# EAGLE design tx (EAGLE 9.1.3)
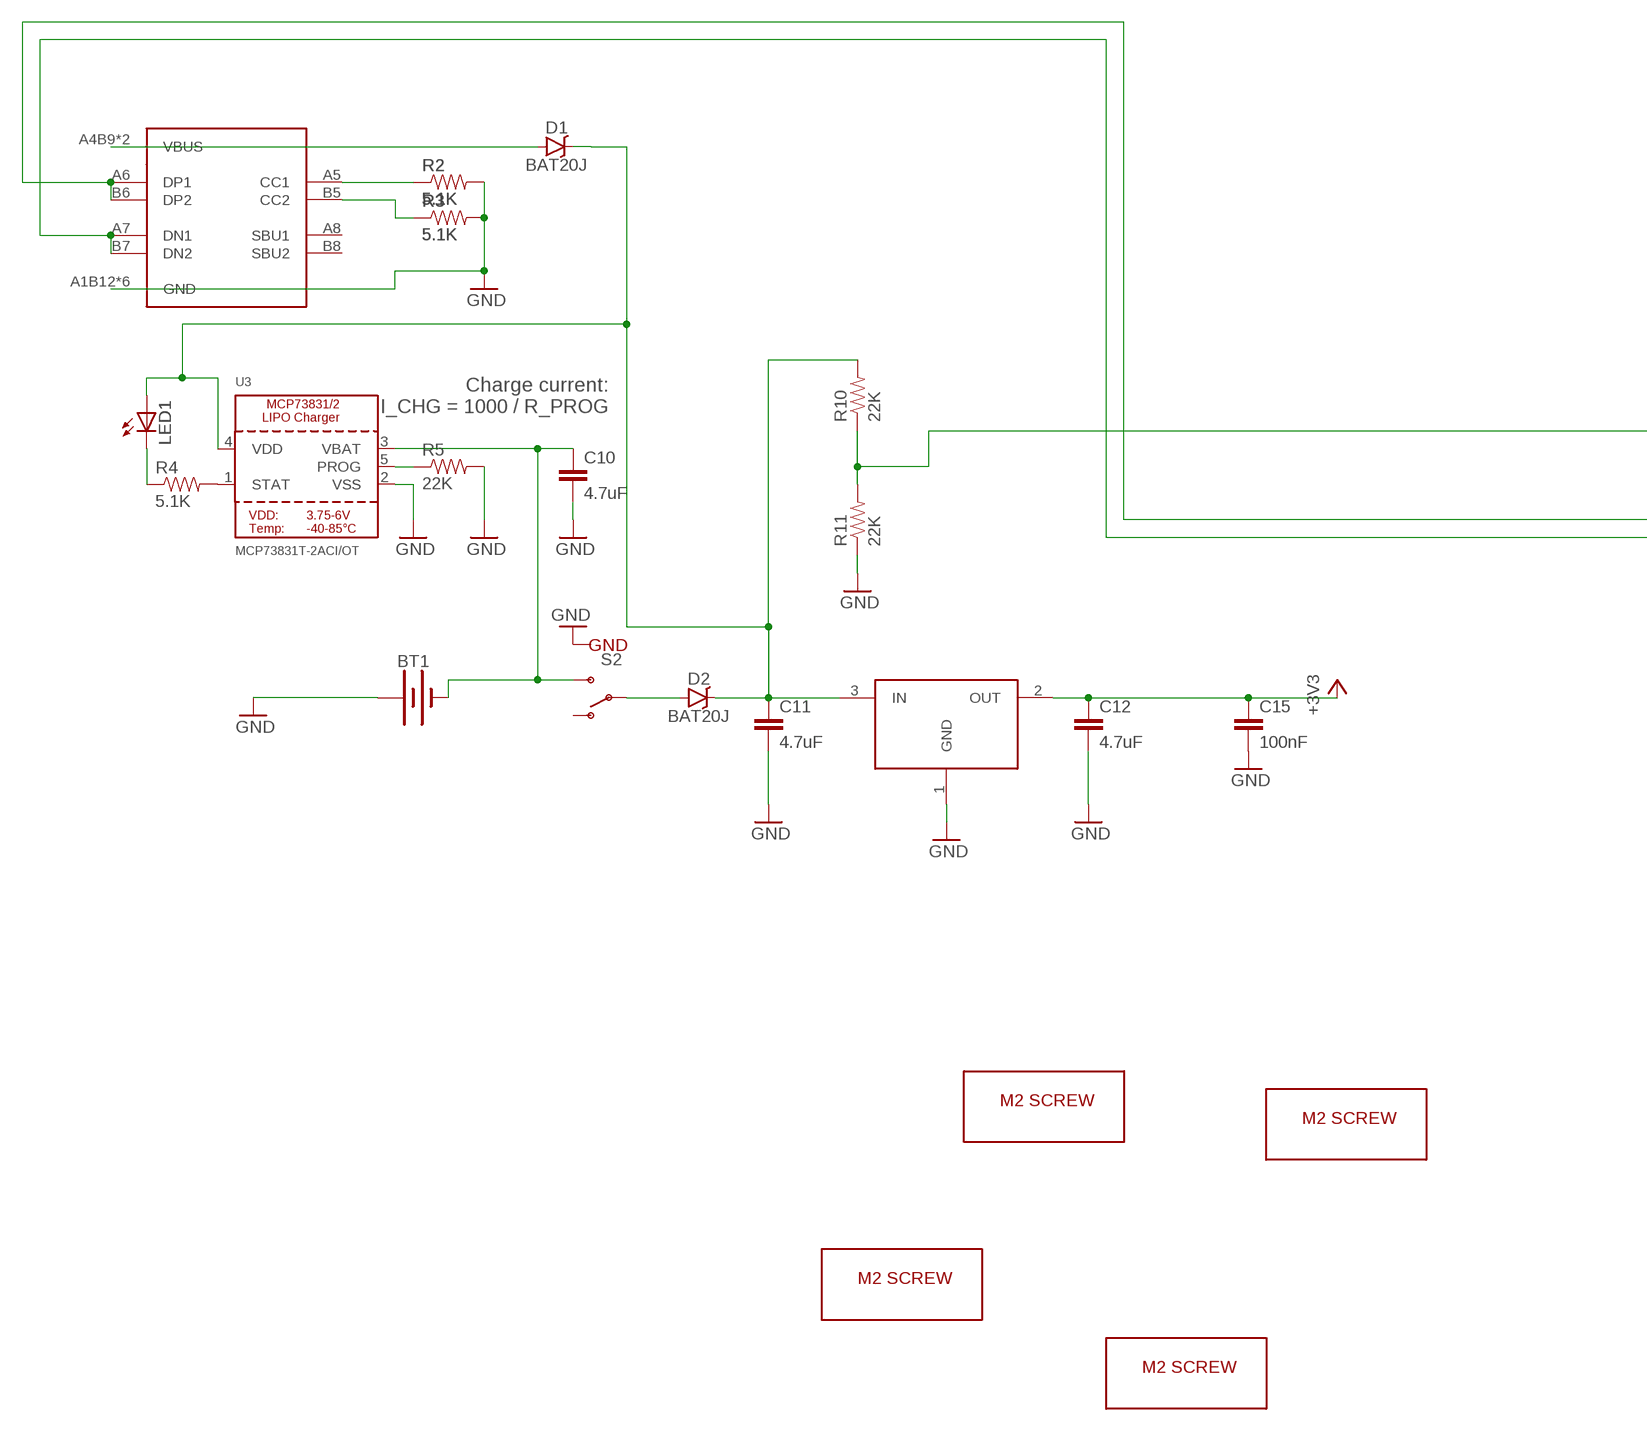
[diagram p0: schematic, sheet 1, part 1 of 2]
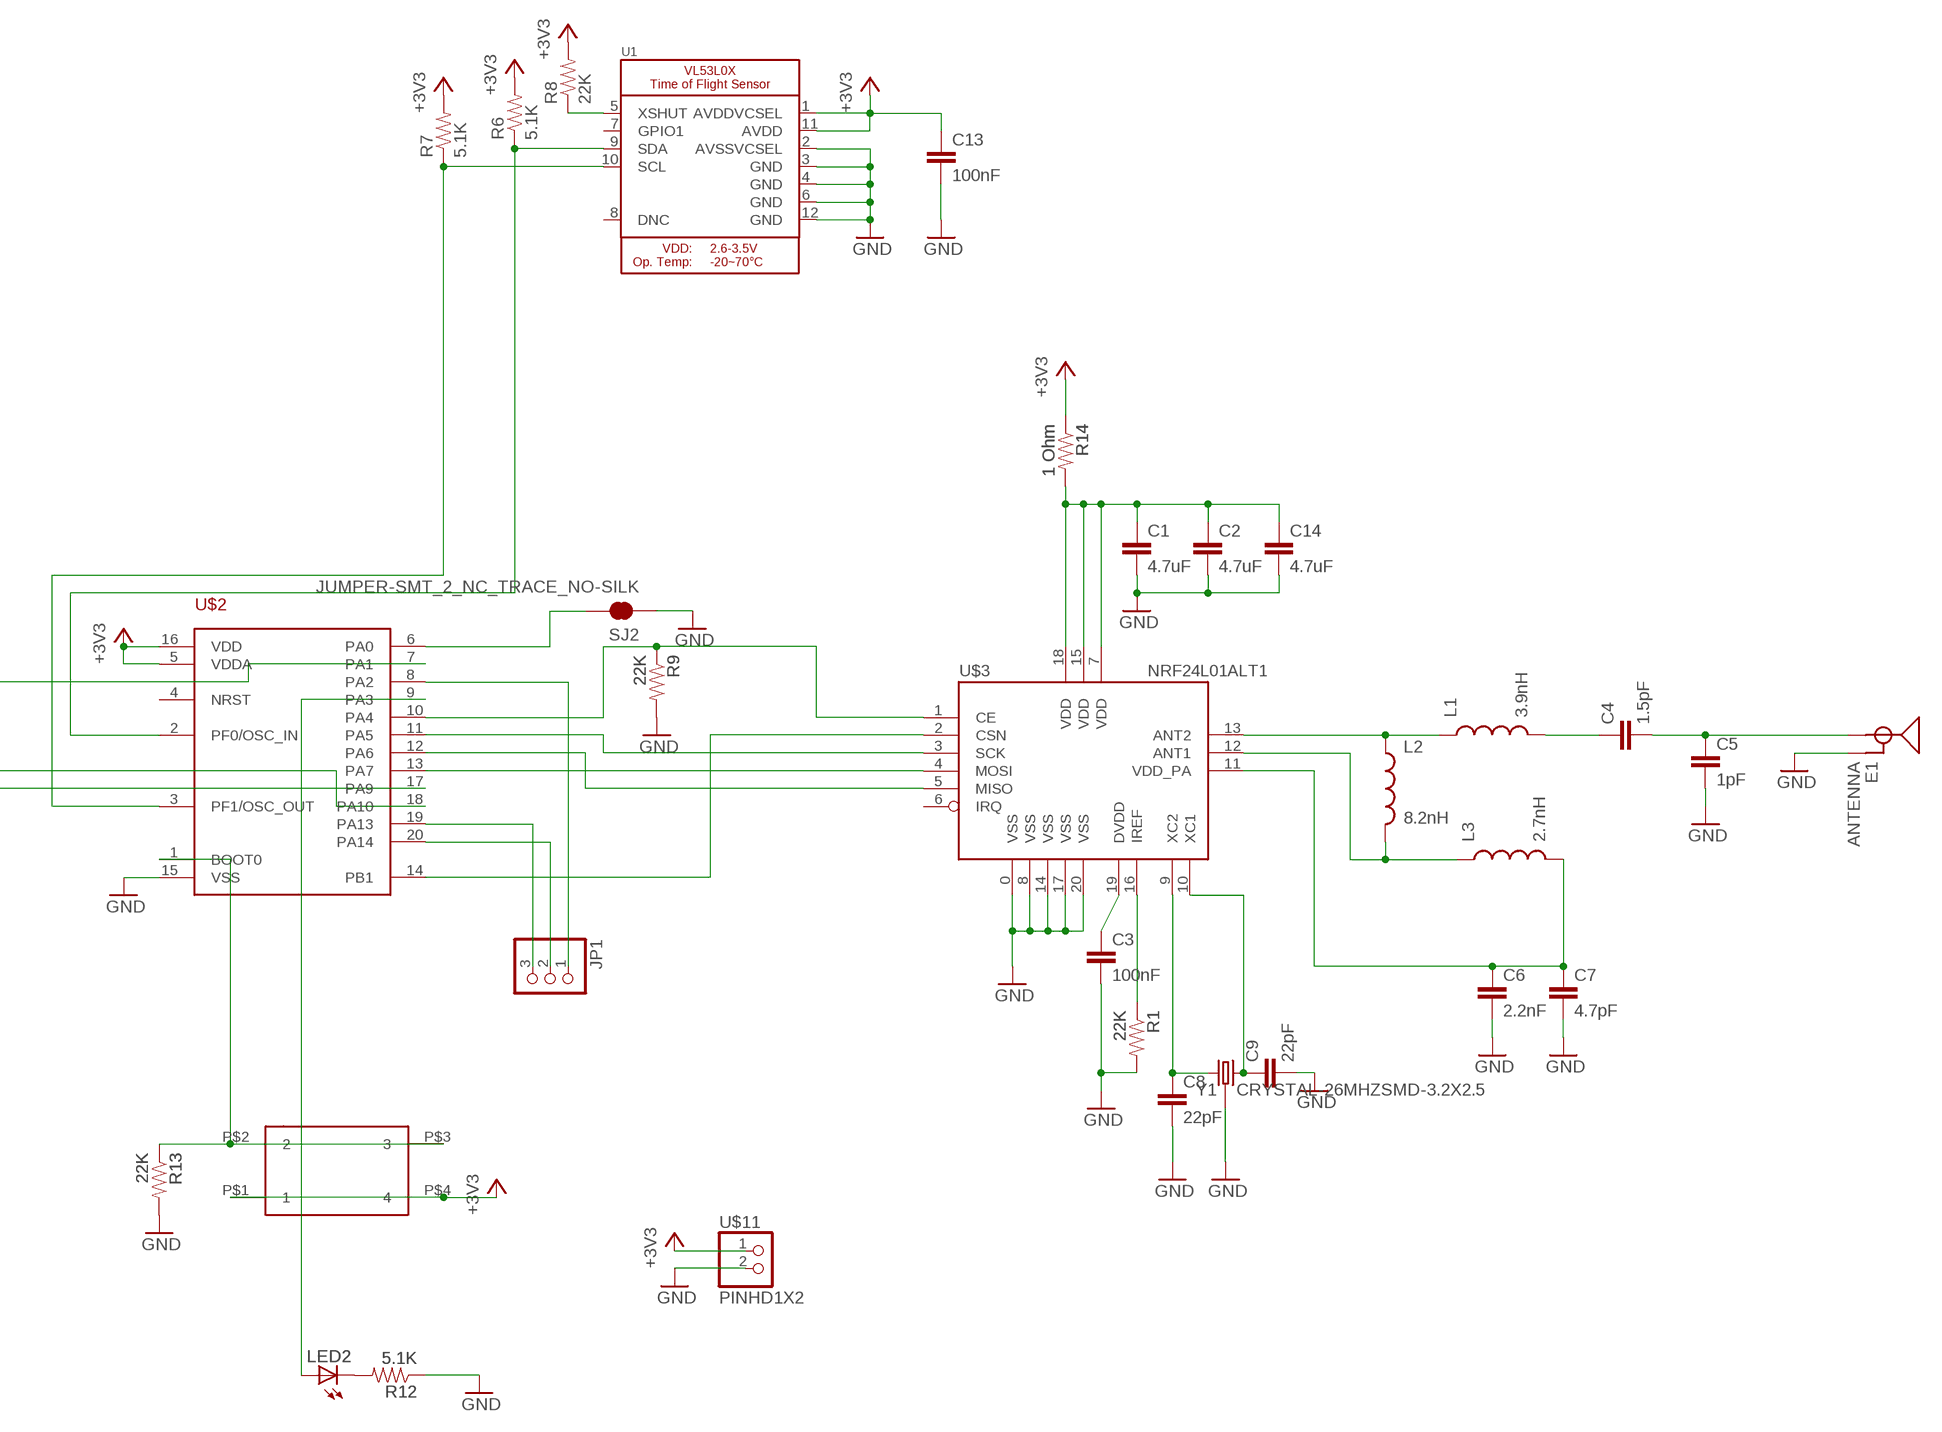
[diagram p1: schematic, sheet 1, part 2 of 2]

## Parts
BT1  TX_SPARKFUN-BATTERIES_BATTERY-24.5MM_PTH  [TX_SPARKFUN-BATTERIES_BATTCON_24.5MM_PTH]
C1  4.7uF  CAP0805  [0805]
C2  4.7uF  CAP0805  [0805]
C3  100nF  CAP0805  [0805]
C4  1.5pF  CAP0805  [0805]
C5  1pF  CAP0805  [0805]
C6  2.2nF  CAP0805  [0805]
C7  4.7pF  CAP0805  [0805]
C8  22pF  CAP0805  [0805]
C9  22pF  CAP0805  [0805]
C10  4.7uF  CAP0805  [0805]
C11  4.7uF  CAP0805  [0805]
C12  4.7uF  CAP0805  [0805]
C13  100nF  CAP0805  [0805]
C14  4.7uF  CAP0805  [0805]
C15  100nF  CAP0805  [0805]
D1  BAT20J  DIODE-SCHOTTKY-BAT20J  [SOD-323]
D2  BAT20J  DIODE-SCHOTTKY-BAT20J  [SOD-323]
E1  ANTENNA  ANTENNATRACE-TUNED  [TRACE_ANTENNA_2.4GHZ_25.7MM_TUNED]
JP1  PINHD-1X3CB  [1X03-CLEANBIG]
L1  3.9nH  INDUCTOR0805  [0805]
L2  8.2nH  INDUCTOR0805  [0805]
L3  2.7nH  INDUCTOR0805  [0805]
LED1  LEDCHIP-LED0805  [CHIP-LED0805]
LED2  LEDCHIP-LED0805  [CHIP-LED0805]
R1  22K  RESISTOR0805-RES  [0805]
R2  5.1K  RESISTOR0805-RES  [0805]
R3  5.1K  RESISTOR0805-RES  [0805]
R4  5.1K  RESISTOR0805-RES  [0805]
R5  22K  RESISTOR0805-RES  [0805]
R6  5.1K  RESISTOR0805-RES  [0805]
R7  5.1K  RESISTOR0805-RES  [0805]
R8  22K  RESISTOR0805-RES  [0805]
R9  22K  RESISTOR0805-RES  [0805]
R10  22K  RESISTOR0805-RES  [0805]
R11  22K  RESISTOR0805-RES  [0805]
R12  5.1K  RESISTOR0805-RES  [0805]
R13  22K  RESISTOR0805-RES  [0805]
R14  1 Ohm  RESISTOR0805-RES  [0805]
S2  SWITCH-SPDTTDFGDFG  [SWITCH-SPST-SMD-A]
SJ2  JUMPER-SMT_2_NC_TRACE_NO-SILK  [SMT-JUMPER_2_NC_TRACE_NO-SILK]
U1  VL53L0X  [LGA12_ST]
U3  MCP73831T-2ACI/OT  MCP73831/2  [SOT23-5]
U$1  M2_SCREW_DEV  [M2_SCREW_FOOT]
U$2  STM32F030F4  [TSSOP20]
U$3  NRF24L01ALT1  [QFN20_ALT1]
U$4  USBC_16P  [USBC_16P_FOOT]
U$9  XC6206_DEV  [SOT23R_INFINEON]
U$10  324_SW324_SWITCH_FOOT_HOLE  [342_SWICH_FOOT_HOLE]
U$11  PINHD1X2  [1X02]
U$12  M2_SCREW_DEV  [M2_SCREW_FOOT]
U$13  M2_SCREW_DEV  [M2_SCREW_FOOT]
U$14  M2_SCREW_DEV  [M2_SCREW_FOOT]
Y1  CRYSTAL-26MHZSMD-3.2X2.5  [CRYSTAL-SMD-3.2X2.5MM]

## Nets
+3V3: C12.1 C13.1 C15.1 R6.2 R7.2 R8.2 R14.1 U1.1(AVDDVCSEL) U1.11(AVDD) U$2.5(VDDA) U$2.16(VDD) U$9.2(OUT) U$10.P$1 U$10.P$4 U$11.1
GND: BT1.2(+) C1.2 C2.2 C3.2 C5.2 C6.2 C7.2 C8.2 C9.2 C10.2 C11.2 C12.2 C13.2 C14.2 C15.2 E1.GND E1.GND2(GND) R1.2 R2.2 R3.2 R5.2 R9.2 R11.1 R12.1 R13.2 S2.G1(GND) S2.G2(GND) S2.G3(GND) S2.G4(GND) SJ2.1 U1.2(AVSSVCSEL) U1.3(GND) U1.4(GND) U1.6(GND) U1.12(GND) U3.2(VSS) U$2.15(VSS) U$3.0(VSS) U$3.8(VSS) U$3.14(VSS) U$3.17(VSS) U$3.20(VSS) U$4.A1B12(GND) U$4.B11A12(GND) U$4.P$13(GND) U$4.P$14(GND) U$4.P$15(GND) U$4.P$16(GND) U$9.1(GND) U$11.2 Y1.2 Y1.4
N$1: C3.1 U$3.19(DVDD)
N$2: R1.1 U$3.16(IREF)
N$3: L1.1 L2.1 U$3.13(ANT2)
N$4: C4.1 L1.2
N$5: C4.2 C5.1 E1.ANT(SIGNAL)
N$6: L2.2 L3.1 U$3.12(ANT1)
N$7: C8.1 U$3.9(XC2) Y1.1
N$8: C6.1 C7.1 L3.2 U$3.11(VDD_PA)
N$9: C9.1 U$3.10(XC1) Y1.3
N$10: R3.1 U$4.B5(CC2)
N$11: R2.1 U$4.A5(CC1)
N$12: LED1.C R4.1
N$13: R4.2 U3.1(STAT)
N$14: U$2.13(PA7) U$3.4(MOSI)
N$15: U$2.12(PA6) U$3.5(MISO)
N$16: U$2.11(PA5) U$3.3(SCK)
N$17: R5.1 U3.5(PROG)
N$18: U$2.18(PA10) U$4.A6(DP1) U$4.B6(DP2)
N$19: D2.A S2.2(P)
N$20: U$2.14(PB1) U$3.2(CSN)
N$21: R9.1 U$2.10(PA4) U$3.1(CE)
N$22: R7.1 U1.10(SCL) U$2.3(PF1/OSC_OUT)
N$23: R6.1 U1.9(SDA) U$2.2(PF0/OSC_IN)
N$24: R8.1 U1.5(XSHUT)
N$25: BT1.1(-) C10.1 S2.3(S) U3.3(VBAT)
N$26: D1.A U$4.A4B9(VBUS) U$4.B4A9(VBUS)
N$27: C11.1 D1.C D2.C LED1.A R10.2 U3.4(VDD) U$9.3(IN)
N$28: LED2.C R12.2
N$29: LED2.A U$2.9(PA3)
N$30: R13.1 U$2.1(BOOT0) U$10.P$2 U$10.P$3
N$31: JP1.3 U$2.19(PA13)
N$32: JP1.2 U$2.20(PA14)
N$33: JP1.1 U$2.8(PA2)
N$34: U$2.17(PA9) U$4.A7(DN1) U$4.B7(DN2)
N$35: R10.1 R11.2 U$2.7(PA1)
N$36: SJ2.2 U$2.6(PA0)
N$37: C1.1 C2.1 C14.1 R14.2 U$3.7(VDD) U$3.15(VDD) U$3.18(VDD)
Unconnected: S2.1(O) U1.7(GPIO1) U1.8(DNC) U$2.4(NRST) U$3.6(IRQ) U$4.A8(SBU1) U$4.B8(SBU2)

## Notes on the sheet
- Charge current:
  I_CHG = 1000 / R_PROG

## Library data of the parts
BT1 = tx:TX_SPARKFUN-BATTERIES_BATTERY: Battery - Single Cell A variety of battery chemistries, sizes, and footprints. Device List: 20MM_PTH - Coin Cell Battery Holder - 20mm (PTH) <https://www.sparkfun.com/products/783> 20MM_PTH_KIT- Coin Cell battery Holder - 20 mm (PTH) <http://www.sparkfun.com/products/783>kit version with special mask 6.8MM_PTH - Coin Cell Battery Holder - 6.8MM(SMD) <https://www.digikey.com/product-detail/en/seiko-instruments/MS621FE-FL11E/728-1057-ND/1889208?WT.srch=1&gclid=CNOQ5a6LzdQCFZS2wAodXCkE0g> 12MM_SMD - Coin Cell Battery Holder - 12mm (SMD) <https://www.sparkfun.com/products/10592> 12MM_PTH - Coin Cell Battery Holder - 12mm (PTH) <https://www.sparkfun.com/products/7948> 20MM_SMD - 20mm Coin Cell Battery Holder (SMD) (2 legs) Used on the Big Time Watch Kit <https://www.sparkfun.com/products/11734> 20MM_SMD_4LEGS - Coin Cell Battery Holder - 20mm (SMD) <https://www.sparkfun.com/products/11892> 20MM_SMD_4LEGS_OVERPASTE - Coin Cell Battery Holder - 20mm (SMD) <https://www.sparkfun.com/products/11892> (Over-paste on the legs) 24.5MM_PTH - Coin Cell Battery Holder - 24.5mm (PTH) <https://www.sparkfun.com/products/8863> 9V - 9V Battery Holder - PC Mount Used on the SparkFun SparkPunk Sound Kit <https://www.sparkfun.com/products/11177> and SparkFun SparkPunk Sequencer Kit <https://www.sparkfun.com/products/12707> 18650 - Battery Holder - 18650 (PTH) <https://www.sparkfun.com/products/13113> AA - Battery Holder - 1xAA (PTH) <https://www.sparkfun.com/products/7949> AAA - Battery Holder - 1xAAA (PTH) <https://www.sparkfun.com/products/12718> AA_KIT - Battery Holder - 1xAA (PTH) <https://www.sparkfun.com/products/7949> Special kit package - pads only have exposed copper on one side of the board. AAA_KIT - Battery Holder - 1xAAA (PTH) <https://www.sparkfun.com/products/12718> Special kit package - pads only have exposed copper on one side of the board.; SF_SKU: PRT-08863
C1-C9 C11-C15 = clock:CAP: Capacitor Standard 0603 ceramic capacitor, and 0.1" leaded capacitor.
C10 = SparkFun-Passives:CAP: Capacitor Standard 0603 ceramic capacitor, and 0.1" leaded capacitor.
D1 D2 = SparkFun-DiscreteSemi:DIODE-SCHOTTKY: Schottky diodes in SFE's production catalog BAT20J 1A 23V 0.62Vf RB751 120mA 40V 0.37Vf PMEG4005EJ 0.5A 40V 0.42Vf MBRA140 1A 40V 0.5Vf B340A 3A 40V SMA; PROD_ID: DIO-11623
E1 = esp32-thing-temp:ANTENNA: Chip antenna Chip antenna with ground or secondary connection. Common with larger metal RF connectors.
JP1 = adafruit_changed:PINHD-1X3: PIN HEADER
L1-L3 = basicBoard:INDUCTOR: Inductors Basic Inductor/Choke - 0603 and 1206. Footprints are not proven and vary greatly between part numbers. INDUCTOR POWER 3.3UH 4.0A SMD 0.197" L x 0.197" W x 0.177" H (5.00mm x 5.00mm x 4.50mm)
LED1 LED2 = joyAnalog:LED: LED OSRAM: - CHIPLED LG R971, LG N971, LY N971, LG Q971, LY Q971, LO R971, LY R971 LH N974, LH R974 LS Q976, LO Q976, LY Q976 LO Q996 - Hyper CHIPLED LW Q18S LB Q993, LB Q99A, LB R99A - SideLED LS A670, LO A670, LY A670, LG A670, LP A670 LB A673, LV A673, LT A673, LW A673 LH A674 LY A675 LS A676, LA A676, LO A676, LY A676, LW A676 LS A679, LY A679, LG A679 - Hyper Micro SIDELED® LS Y876, LA Y876, LO Y876, LY Y876 LT Y87S - SmartLED LW L88C, LW L88S LB L89C, LB L89S, LG L890 LS L89K, LO L89K, LY L89K LS L896, LA L896, LO L896, LY L896 - TOPLED LS T670, LO T670, LY T670, LG T670, LP T670 LSG T670, LSP T670, LSY T670, LOP T670, LYG T670 LG T671, LOG T671, LSG T671 LB T673, LV T673, LT T673, LW T673 LH T674 LS T676, LA T676, LO T676, LY T676, LB T676, LH T676, LSB T676, LW T676 LB T67C, LV T67C, LT T67C, LS T67K, LO T67K, LY T67K, LW E67C LS E67B, LA E67B, LO E67B, LY E67B, LB E67C, LV E67C, LT E67C LW T67C LS T679, LY T679, LG T679 LS T770, LO T770, LY T770, LG T770, LP T770 LB T773, LV T773, LT T773, LW T773 LH T774 LS E675, LA E675, LY E675, LS T675 LS T776, LA T776, LO T776, LY T776, LB T776 LHGB T686 LT T68C, LB T68C - Hyper Mini TOPLED® LB M676 - Mini TOPLED Santana® LG M470 LS M47K, LO M47K, LY M47K Source: http://www.osram.convergy.de/
R1-R3 R9 R12-R14 = joyAnalog:RESISTOR: Resistor Basic schematic elements and footprints for 0603, 1206, and PTH resistors.
R4-R8 R10 R11 = SparkFun-Passives:RESISTOR: Resistor Basic schematic elements and footprints for 0603, 1206, and PTH resistors.
S2 = tx:SWITCH-SPDT: SPDT Switch Simple slide switch, Spark Fun Electronics SKU : COM-00102 DPDT SMT slide switch, AYZ0202, SWCH-08179
SJ2 = SparkFun-Jumpers:JUMPER-SMT_2_NC_TRACE: Normally closed trace jumper This jumper has a trace between two pads so it's normally closed (NC). Use a razor knife to open the connection. For best results follow the IPC guidelines for cutting traces: Cutout at least 0.063 mm (0.005 in). Remove all loose material to clean up the cut area. Seal the cut with an approved epoxy. Reapply solder to reclose the connection.
U1 = Adafruit VL53L0X:VL53L0X: VL53L0X - Laser Time of Flight Sensor (2M range)
U3 = microbuilder:MCP73831/2: MCP73831/2 LIPO Charger VDD: 3.75 - 6V Temp -40 - 85°C Programmable Charge Rate: 15-500mA NOTE: STAT is a tri-state logic output on the MCP73831 and an open-drain output on the MCP73832. SOT23-5 with 4.2V output and tri-state logic on STAT = MCP73831T-2ACI/OT
U$1 U$12-U$14 = 3pos_slide_switch:M2_SCREW_DEV
U$2 = exixe_pogo:STM32F030F4
U$3 = nRF24L01-Chip-v13:NRF24L01: 2.4GHz Low Power Transceiver This is the very popular, low cost, very low power RF transceiver from Nordic Semiconductor. Simple SPI interface. SKU: COM-00690
U$4 = my_usbc_16p:USBC_16P
U$9 = 3pos_slide_switch:XC6206_DEV
U$10 = 3pos_slide_switch:324_SW
U$11 = adafruit_changed:PINHD1X2
Y1 = SparkFun-Clocks:CRYSTAL-26MHZ: 26MHz Crystal w/ Ground Pin Digikey Example <http://www.digikey.com/product-detail/en/epson/TSX-3225%2026.0000MF09Z-AC3/SER3627CT-ND/1802878> Frequency: 26MHz Frequency Stability: ±9ppm Frequency Tolerance: ±10ppm Load Capacitance: 9pF SparkFun Products: SparkFun ESP32 Thing <https://www.sparkfun.com/products/13907> SparkFun ESP8266 Thing Dev Board <https://www.sparkfun.com/products/13711>; PROD_ID: XTAL-12454

## Board
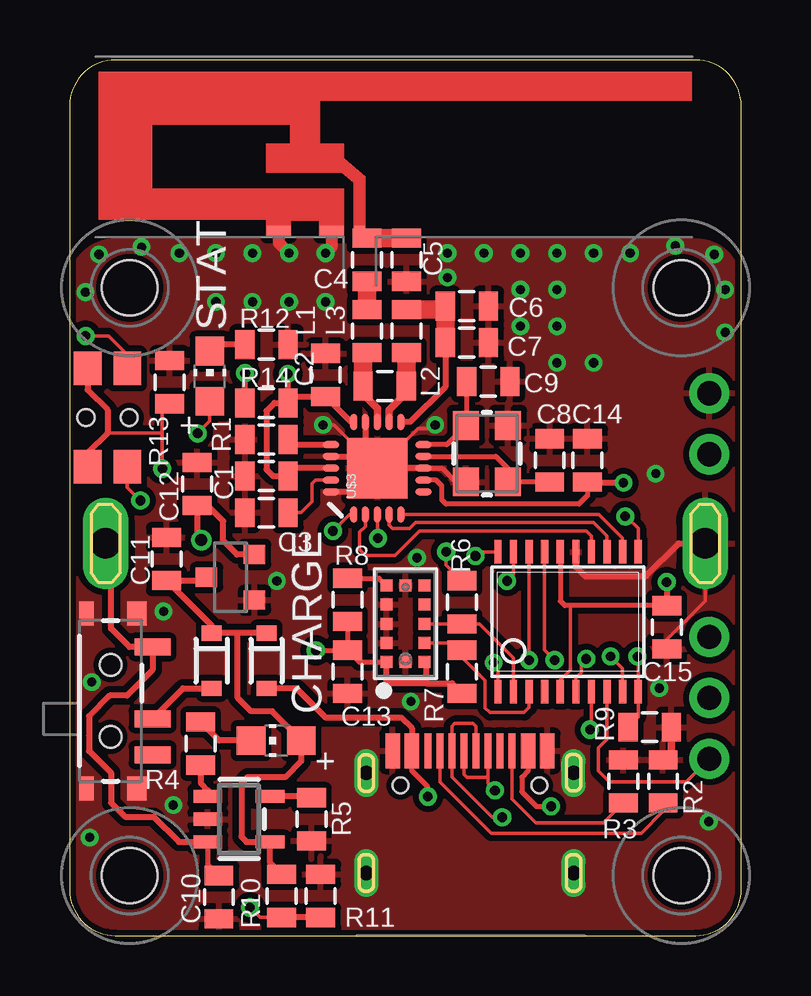
[diagram p2: board, top side]
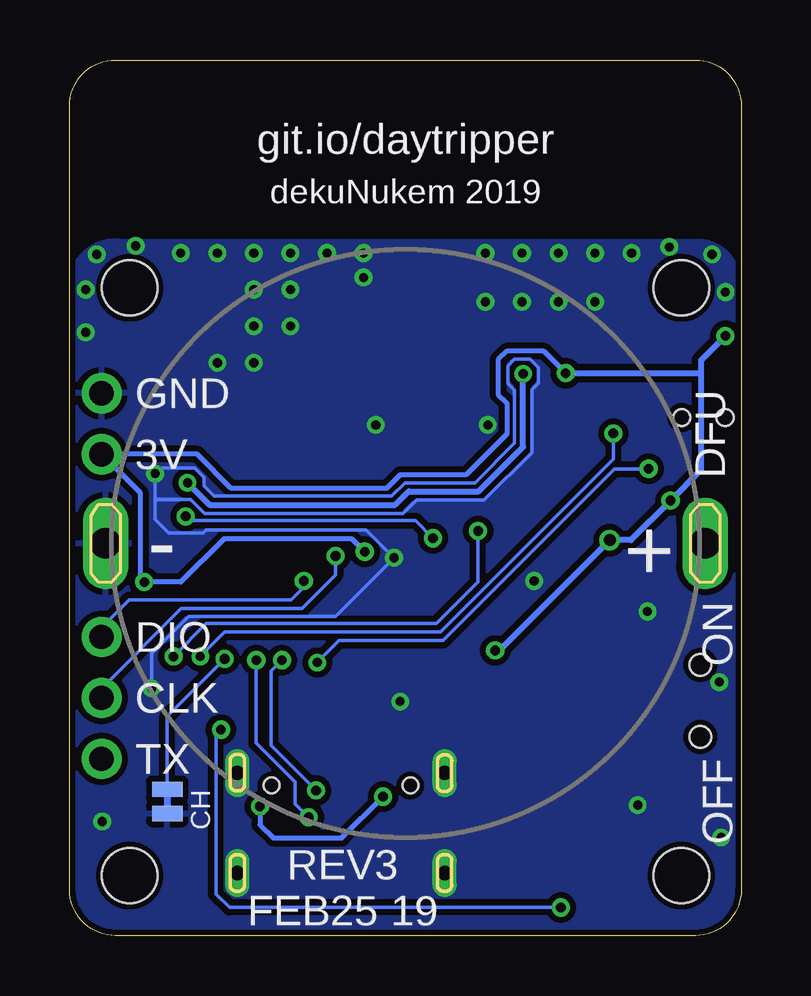
[diagram p3: board, bottom side, seen from below]

Size 28 x 36.5 mm. Coordinates in mm from the lower left corner, seen from the top.
Outline: 0,34.59 0,1.91 arc90 1.91,0 26.09,0 arc90 28,1.91 28,34.59 arc90 26.09,36.5 1.91,36.5 arc90 0,34.59
Copper layers (1*16): Top 0.035mm / dielectric 1.5mm / Bottom 0.035mm
Design rules "SparkFun-2-layer-6mil *": minimum track width 6mil, minimum drill 15mil, track to track 6mil, track to pad 6mil, pad to pad 6mil, via to via 6mil, smd to smd 6mil, copper to edge 8mil, drill to drill 6mil, minimum pad ring 7mil, minimum via ring 7mil, stop-mask expansion 4mil, vias tented up to drill 25mil, thermal gap 10mil

### Footprints (pad centres in the part's own frame; a part is rotated, then mirrored left to right if it is on the bottom)
TX_SPARKFUN-BATTERIES_BATTCON_24.5MM_PTH = drill 1.27 long: 1 -12.5,0; 2 12.5,0
0805 = smd 0.8 x 1.2: 1 -0.9,0; 2 0.9,0
SOD-323 = smd 0.63 x 0.83: A 1.15,0; C -1.15,0
TRACE_ANTENNA_2.4GHZ_25.7MM_TUNED = smd 0.46 x 0.46: ANT 0,0.23 | smd 1 x 0.46: GND -1.18,0.23; GND2 -3.38,0.23
1X03-CLEANBIG = drill 1.016 pad 1.676: 1 -2.54,0; 2 0,0; 3 2.54,0
CHIP-LED0805 = smd 1.2 x 1.2: A 0,-1.05; C 0,1.05
SWITCH-SPST-SMD-A = smd 0.7 x 1.5: 1 -2.25,-1.75; 2 -0.75,-1.75; 3 2.25,-1.75 | smd 1 x 0.6: G1 -3.65,1; G3 3.65,1 | smd 1 x 0.8: G2 -3.65,-1.1; G4 3.65,-1.1 | hole 0.9: -1.5,0; 1.5,0
SMT-JUMPER_2_NC_TRACE_NO-SILK = smd 0.635 x 1.27: 1 -0.508,0; 2 0.508,0
LGA12_ST = smd 0.5 x 0.5: 1 1.6,-0.8; 2 0.8,-0.8; 3 0,-0.8; 4 -0.8,-0.8; 5 -1.6,-0.8; 6 -1.6,0; 7 -1.6,0.8; 8 -0.8,0.8; 9 0,0.8; 10 0.8,0.8; 11 1.6,0.8; 12 1.6,0
SOT23-5 = smd 0.55 x 1.2: 1 -0.95,-1.3; 2 0,-1.3; 3 0.95,-1.3; 4 0.95,1.3; 5 -0.95,1.3
M2_SCREW_FOOT = hole 2.3: 0,0
TSSOP20 = smd 0.305 x 0.991: 1 -2.925,-2.918; 2 -2.275,-2.918; 3 -1.625,-2.918; 4 -0.975,-2.918; 5 -0.325,-2.918; 6 0.325,-2.918; 7 0.975,-2.918; 8 1.625,-2.918; 9 2.275,-2.918; 10 2.925,-2.918; 11 2.925,2.918; 12 2.275,2.918; 13 1.625,2.918; 14 0.975,2.918; 15 0.325,2.918; 16 -0.325,2.918; 17 -0.975,2.918; 18 -1.625,2.918; 19 -2.275,2.918; 20 -2.925,2.918
QFN20_ALT1 = smd 2.515 x 2.515: 0 0,0 | smd 0.686 x 0.293: 1 -1.925,0.986; 2 -1.925,0.493; 3 -1.925,0; 4 -1.925,-0.493; 5 -1.925,-0.986; 11 1.925,-0.986; 12 1.925,-0.493; 13 1.925,0; 14 1.925,0.493; 15 1.925,0.986 | smd 0.293 x 0.686: 6 -0.986,-1.925; 7 -0.493,-1.925; 8 0,-1.925; 9 0.493,-1.925; 10 0.986,-1.925; 16 0.986,1.925; 17 0.493,1.925; 18 0,1.925; 19 -0.493,1.925; 20 -0.986,1.925
USBC_16P_FOOT = smd 0.6 x 1.45: A1B12 0,0; A4B9 0.8,0; B4A9 5.65,0; B11A12 6.45,0 | smd 0.3 x 1.45: A5 1.975,0; A6 2.975,0; A7 3.475,0; A8 4.475,0; B5 4.975,0; B6 3.975,0; B7 2.475,0; B8 1.475,0 | drill 0.6 pad 1 long: P$13 -1.095,-0.915; P$14 7.545,-0.915; P$15 -1.095,-5.095; P$16 7.545,-5.095 | hole 0.65: 0.335,-1.445; 6.115,-1.445
SOT23R_INFINEON = smd 0.8 x 0.9: 1 -0.95,-1; 2 0.95,-1; 3 0,1
342_SWICH_FOOT_HOLE = smd 1.4 x 1.15: P$1 -2.05,-0.825; P$2 -2.05,0.825; P$3 2.05,0.825; P$4 2.05,-0.825 | hole 0.7: 0,0.9; 0,-0.9
1X02 = drill 1.016 pad 1.676: 1 -1.27,0; 2 1.27,0
CRYSTAL-SMD-3.2X2.5MM = smd 1.2 x 1.1: 1 -1.175,-0.875; 2 1.175,-0.875; 3 1.175,0.875; 4 -1.175,0.875

### Placement (x,y rotation side)
BT1  14,16.35 180 bottom
C1  8.2,19.15 180 top
C2  10.67,23.37 90 top
C3  8.2,17.63 180 top
C4  12.4,28.17 90 top
C5  14.05,28.17 270 top
C6  16.56,26.24 0 top
C7  16.56,24.71 0 top
C8  20.02,19.81 90 top
C9  17.45,23.09 0 top
C10  6.22,1.6 270 top
C11  4.04,15.7 90 top
C12  5.31,18.82 90 top
C13  11.58,11 270 top
C14  21.59,19.81 90 top
C15  24.89,12.85 270 top
D1  8.2,11.46 270 top
D2  5.92,11.46 270 top
E1  12.09,29.11 0 top
JP1  26.67,9.91 90 top
L1  12.4,25.2 90 top
L2  13.13,22.91 0 top
L3  14.05,25.2 90 top
LED1  8.61,8.13 90 top
LED2  5.84,23.32 0 top
R1  8.2,20.68 180 top
R2  24.74,6.43 90 top
R3  23.09,6.43 90 top
R4  5.46,8 270 top
R5  10.08,4.85 270 top
R6  16.36,13.89 90 top
R7  16.36,11 270 top
R8  11.58,14 270 top
R9  24.18,8.69 0 top
R10  8.84,1.65 90 top
R11  10.46,1.65 270 top
R12  8.2,24.64 180 top
R13  4.17,23.06 90 top
R14  8.2,22.2 0 top
S2  1.7,9.78 90 top
SJ2  23.93,5.59 90 bottom
U1  14,13 270 top
U3  7.06,4.85 270 top
U$1  2.5,2.5 0 top
U$2  20.78,13.08 0 top
U$3  12.83,19.48 90 top
U$4  13.46,7.7 0 top
U$9  6.71,14.94 90 top
U$10  1.57,21.59 90 top
U$11  26.67,21.34 90 top
U$12  25.5,2.5 0 top
U$13  2.5,27 0 top
U$14  25.5,27 0 top
Y1  17.4,20.09 90 top

### Tracks (layer width: path | path; a pad name or v marks a point on that pad's centre or on a via)
+3V3  (via drill 0.4, 0.5)
  Top 0.152: R6.2 15.7,15.45 v15.7,16 | U$2.5 20.45,10.65 20.87,11.06 20.87,13.74 | U$10.P$4 2.4,24.22 1.63,24.99 v0.66,24.99 | U$10.P$1 2.4,18.68 v2.95,18.14
  Top 0.203: R8.2 C13.1 | C13.1 12.08,11.4 U1.1 | v10.26,11.89 11.57,11.89 C13.1 | U$2.16 20.45,13.94 20.64,13.75 20.88,13.75 | C15.1 20.88,13.75 | 20.87,13.74 20.88,13.75
  Top 0.254: U1.1 13.2,10.52 14.85,10.52 | 14.85,10.52 14.85,11.35 U1.11 | 14.85,10.52 15.94,10.52 R7.2 | v24.89,14.73 C15.1 | U$9.2 6.97,15.88 6.4,16.46 6.4,17.27 5.75,17.92 C12.1 5.31,16.66 v5.49,16.48 | R14.1 7.3,23.43 v7.32,23.44
  Bottom 0.203: v7.32,23.44 8.23,24.36 9.78,24.36 10.13,24 10.13,22.55 9.78,22.2 9.78,20.9 11.48,19.2 14.22,19.2 14.78,18.64 21.26,18.64 22.68,20.07 U$11.1 25.07,18.47 25.07,14.91 v24.89,14.73 23.37,14.73 21.57,16.54 16.23,16.54 v15.7,16
  Bottom 0.254: v0.66,24.99 1.68,23.98 1.68,23.47 | v10.26,11.89 10.08,11.89 v5.49,16.48 4.6,16.48 v2.95,18.14 1.68,19.41 1.68,23.47 | v7.32,23.44 1.7,23.44 1.68,23.47
GND  (via drill 0.38)
  Top 0.152: U$3.0 12.33,19.98 | BT1.2 26.5,13.95 24.89,12.34 C15.2 | v10.57,21.29 11.02,21.29 11.68,20.62 12.33,20.62 | v15.24,21.29 15.09,21.13 14.53,21.13 13.92,20.52 12.38,20.52 12.33,20.57
  Top 0.203: U$3.8 15.52,19.48 16.09,18.92 Y1.4
  Top 0.254: U$3.17 11.79,19.98 | U$3.20 11.79,18.5 11.79,19.98 | U$3.14 12.33,20.62 12.33,20.57 12.33,19.98 11.79,19.98 | U$3.8 U$3.0 | U$2.15 21.1,15.37 21.49,14.99 24.03,14.99 25.39,16.35 BT1.2
  Top 0.305: R2.2 25.08,7.67 R9.2
  Top 0.508: E1.GND2 8.71,28.88 v9.14,28.45 | E1.GND 10.91,28.69 v10.67,28.45
  Bottom 0.152: v24.59,10.31 24.59,11.76 23.04,13.31 16.92,13.31 v14.48,15.75 15.65,16.92 22.3,16.92 22.43,16.79 23.88,16.79 24.43,17.35 24.43,18.21 | 24.43,18.21 v24.43,19.25 24.21,19.48 22.78,19.48 22.4,19.1 22.4,18.75 21.97,18.31 14.58,18.31 14.02,18.87 11.1,18.87 9.45,20.52 9.45,22.73 9.73,23.01 9.73,23.75 9.45,24.03 8.81,24.03 8.46,23.67 8.46,23.04 8.74,22.76 8.74,20.14 10.72,18.16 13.54,18.16 14.1,17.6 22.38,17.6 22.96,18.19 24.41,18.19 24.43,18.21
  other vias: 15.75,28.45 15.75,27.43 17.27,28.45 18.8,28.45 20.32,28.45 21.84,28.45 23.37,28.45 18.8,25.4 18.8,26.92 7.62,28.45 6.1,28.45 4.57,28.45 10.67,26.42 0.91,10.57 4.32,5.44 0.84,4.09 8.64,14.78 26.64,4.75 20.32,23.88 20.32,26.92 20.32,25.4 14.22,9.75 1.22,28.4 0.66,26.82 3,28.7 25.25,28.75 26.87,28.4 27.33,26.92 27.33,25.15 3.91,13.51 6.1,26.42 7.62,26.42 9.14,26.42 21.84,23.88
  pour Top (isolate 0.254): 0,27.09 0,1.91 arc90 1.91,0 26.09,0 arc90 28,1.91 28,27.09 arc90 26.09,29 1.91,29 arc90
  pour Bottom (isolate 0.254): 0,27.09 0,1.91 arc90 1.91,0 26.09,0 arc90 28,1.91 28,27.09 arc90 26.09,29 1.91,29 arc90
N$1
  Top 0.152: U$3.19 10.25,18.99 10.11,18.85 10.11,18.09 9.65,17.63 C3.1
N$2
  Top 0.254: R1.1 9.31,20.47 U$3.16
N$3
  Top 0.254: 12.23,22.57 L2.1
  Top 0.305: U$3.13 12.83,21.97 12.65,22.15 12.23,22.57
  Top 0.61: 12.23,24.13 L1.1
  Top 0.762: L2.1 12.23,24.13
N$4
  Top 0.762: L1.2 C4.1
N$5
  Top 0.508: E1.ANT 12.12,29.34 C4.2
  Top 0.762: C5.1 C4.2
N$6
  Top 0.254: 14.03,22.62 L2.2
  Top 0.305: U$3.12 13.32,21.91 14.03,22.62
  Top 0.61: L2.2 14.05,22.93
  Top 0.762: 14.05,22.93 L3.1
N$7
  Top 0.203: U$3.9 17.77,19.98 18.27,19.47 Y1.1 C8.1
N$8
  Top 0.254: U$3.11 14.19,21.41 15.66,22.87 C7.1
  Top 0.762: L3.2 15.52,26.1 | 15.52,26.1 C6.1 | C7.1 15.66,25.95 15.52,26.1
N$9
  Top 0.203: U$3.10 15.73,20.47 Y1.3 16.55,21.29 C9.1
N$10
  Top 0.152: U$4.B5 18.44,5.69 19.44,4.69 22.25,4.69 R3.1
N$11
  Top 0.152: R2.1 24.74,5.18 23.82,4.27 17.58,4.27 15.44,6.41 U$4.A5
N$12
  Top 0.254: LED1.C 6.23,8.13 R4.1
N$13
  Top 0.254: R4.2 5.46,6.36 5.76,6.05 U3.1
N$14
  Top 0.152: U$3.4 13.32,17.11 13.46,16.97 14.17,16.97 14.43,17.22 21.84,17.22 22.4,16.66 U$2.13
N$15
  Top 0.152: U$3.5 22.07,17.56 23.05,16.57 U$2.12
N$16  (via drill 0.4)
  Top 0.152: U$3.3 12.83,16.59 v12.85,16.56 | v23.16,17.48 23.19,17.48 23.7,16.96 U$2.11
  Bottom 0.152: v23.16,17.48 22.99,17.3 13.59,17.3 v12.85,16.56
N$17
  Top 0.254: R5.1 10.03,5.8 U3.5
N$18  (via drill 0.4)
  Top 0.152: U$4.B6 17.44,6.6 | 17.44,6.6 17.44,6.34 v17.73,6.04 | U$4.A6 16.44,6.73 16.56,6.6 17.44,6.6 | U$2.18 v19.15,11.48 | v19.15,11.48
  Bottom 0.152: v19.15,11.48 19.61,11.02 19.61,7.92 v17.73,6.04
N$19
  Top 0.254: S2.2 4.73,10.3 D2.A
N$20
  Top 0.152: U$3.2 12.33,17.06 12.09,16.82 12.09,16.1 12.34,15.85 13.56,15.85 14.58,16.87 21.54,16.87 21.75,16.65 U$2.14
N$21  (via drill 0.4)
  Top 0.152: v23.67,11.63 23.7,11.6 U$2.10 23.7,9.11 R9.1 | U$3.1 11.66,17.56 v10.97,16.87
  Bottom 0.152: v23.67,11.63 22.3,13.01 12.7,13.01 10.97,14.73 v10.97,16.87
N$22
  Top 0.152: U1.10 16.06,12.2 R7.1 16.36,11.59 17.32,10.63 17.32,9.5 17.53,9.3 18.95,9.3 19.15,9.5 U$2.3
N$23
  Top 0.152: U$2.2 18.5,11.57 17.08,12.99 R6.1 U1.9
N$24
  Top 0.203: R8.1 12.9,14.89 U1.5
N$25
  Top 0.203: U3.3 5.76,2.96 C10.1
  Top 0.254: U3.3 4.56,3.9 3.5,4.95 2.31,4.95 1.73,5.54 1.73,6.78 0.81,7.7 0.81,8.33 0.81,9.14 1.68,10.01 2.39,10.01 3.45,11.07 S2.3 2.5,12.03 1.73,12.8 1.73,16.12 BT1.1
N$26  (via drill 0.4)
  Top 0.203: U$4.B4A9 19.11,6.87 18.85,6.6 18.85,5.99 19.46,5.38 v20.07,5.38 | v14.94,5.79 14.94,6.2 14.26,6.87 U$4.A4B9
  Top 0.254: D1.A 9.46,10.3 10.67,9.09 13.82,9.09 14.26,8.65 U$4.A4B9
  Bottom 0.203: v20.07,5.38 20.07,4.62 19.51,4.06 16.66,4.06 v14.94,5.79
N$27
  Top 0.254: D1.C 7.01,12.61 | 7.01,12.61 D2.C 5.92,12.92 C11.1 5.57,14.8 | 7.01,12.61 7.01,9.91 7.57,9.35 8.44,9.35 LED1.A 9.66,7.27 8.99,6.6 7.42,6.6 7.16,6.35 7.16,4.12 7.38,3.9 U3.4 8.36,3.03 R10.2 | 5.57,14.8 U$9.3 5.57,14.8
N$28
  Top 0.254: R12.2 6.11,24.64 LED2.C
N$29  (via drill 0.38, 0.4)
  Top 0.152: U$2.9 23.05,11.14 v22.55,11.63 | LED2.A 5.84,21.44 v5.33,20.93
  Bottom 0.152: v22.55,11.63 21.54,12.65 12.55,12.65 5.33,19.86 v5.33,20.93
N$30  (via drill 0.38, 0.4)
  Top 0.152: v17.68,11.38 17.85,11.21 U$2.1 | 3.86,20.95 v3.86,19.46 | 1.57,20.95 3.86,20.95 | R13.1 3.86,22.16 3.86,20.95
  Top 0.254: U$10.P$3 0.75,22.75 1.57,21.92 1.57,20.95 0.75,20.13 U$10.P$2
  Bottom 0.152: v17.68,11.38 16.76,12.29 12.45,12.29 5.28,19.46 v3.86,19.46
N$31  (via drill 0.4)
  Top 0.152: U$2.19 18.5,15.05 v18.24,14.78
  Bottom 0.152: v18.24,14.78 18.24,14.53 18.77,13.99 25.53,13.99 26.67,12.85 JP1.3
N$32  (via drill 0.4)
  Top 0.152: U$2.20 17.09,16 v16.92,15.82
  Bottom 0.152: v16.92,15.82 16.92,15.04 18.31,13.64 23.34,13.64 26.67,10.31 JP1.2
N$33
  Top 0.152: JP1.1 25.7,6.4 22.5,6.4 22.05,6.86 22.05,7.82 22.4,8.18 U$2.8
N$34  (via drill 0.4)
  Top 0.152: U$4.A7 16.94,8.72 16.82,8.84 16.05,8.84 15.94,8.72 U$4.B7 15.94,6.62 17.63,4.93 v18.03,4.93 | U$2.17 19.8,11.9 v20.22,11.48
  Bottom 0.152: v18.03,4.93 18.59,5.49 18.59,6.4 20.22,8.03 v20.22,11.48
N$35  (via drill 0.4)
  Top 0.152: v7.52,1.17 7.94,0.75 R10.1 | U$2.7 21.75,8.65 v21.69,8.59
  Top 0.254: R11.2 R10.1
  Bottom 0.152: v21.69,8.59 21.89,8.38 21.89,1.73 21.34,1.17 v7.52,1.17
N$36  (via drill 0.4)
  Top 0.152: U$2.6 21.1,10.74 21.34,10.97 21.34,11.33 v21.54,11.53
  Bottom 0.152: SJ2.2 23.93,9.14 v21.54,11.53
N$37  (via drill 0.38)
  Top 0.203: U$3.7 15.28,18.99 15.52,18.75 15.52,18.16 15.7,17.98 21.23,17.98 21.59,18.34 C14.1
  Top 0.254: U$3.18 9.43,19.48 C1.1 8.48,19.15 8.2,19.43 8.2,21.87 8.53,22.2 R14.2 | U$3.15 11.73,21.41 C2.1 10.64,22.44 9.35,22.44 R14.2 | R14.2 9.1,23.41 v9.09,23.42 | v23.09,18.87 21.63,18.87 C14.1
  Bottom 0.254: v23.09,18.87 22.17,17.96 14.43,17.96 13.87,18.52 10.95,18.52 9.09,20.37 v9.09,23.42

### Text on the board
tNames: STAT | CHARGE
bNames: git.io/daytripper | dekuNukem 2019 | DFU | GND | 3V | - | ON | DIO | CLK | OFF | TX | CH | REV3 / FEB25 19